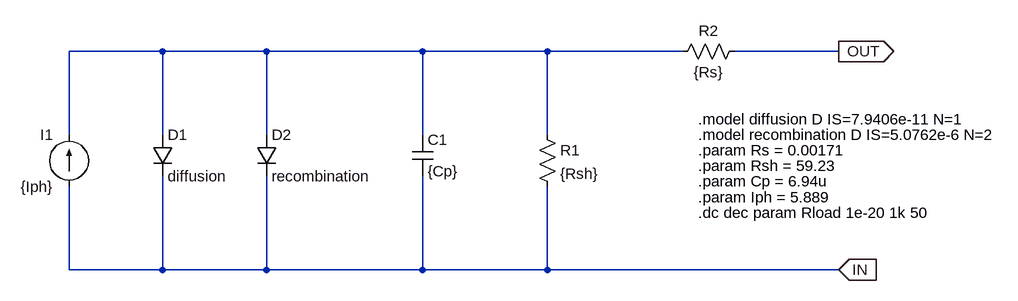
[diagram p0: schematic jac-cell.asc]
jac-cell.asc, the LTspice schematic file:
Version 4
SHEET 1 1300 784
WIRE 144 -16 0 -16
WIRE 304 -16 144 -16
WIRE 544 -16 304 -16
WIRE 736 -16 544 -16
WIRE 944 -16 736 -16
WIRE 1184 -16 1024 -16
WIRE 0 112 0 -16
WIRE 144 112 144 -16
WIRE 304 112 304 -16
WIRE 544 112 544 -16
WIRE 736 112 736 -16
WIRE 0 320 0 192
WIRE 144 320 144 176
WIRE 144 320 0 320
WIRE 304 320 304 176
WIRE 304 320 144 320
WIRE 544 320 544 176
WIRE 544 320 304 320
WIRE 736 320 736 192
WIRE 736 320 544 320
WIRE 1184 320 736 320
FLAG 1184 320 IN
IOPIN 1184 320 In
FLAG 1184 -16 OUT
IOPIN 1184 -16 Out
SYMBOL current 0 192 R180
WINDOW 0 24 80 Left 2
WINDOW 3 24 0 Left 2
SYMATTR InstName I1
SYMATTR Value {Iph}
SYMBOL diode 128 112 R0
SYMATTR InstName D1
SYMATTR Value diffusion
SYMBOL diode 288 112 R0
SYMATTR InstName D2
SYMATTR Value recombination
SYMBOL cap 528 112 R0
SYMATTR InstName C1
SYMATTR Value {Cp}
SYMBOL res 720 96 R0
SYMATTR InstName R1
SYMATTR Value {Rsh}
SYMBOL res 928 0 R270
WINDOW 0 32 56 VTop 2
WINDOW 3 0 56 VBottom 2
SYMATTR InstName R2
SYMATTR Value {Rs}
TEXT 968 88 Left 2 !.model diffusion D IS=7.9406e-11 N=1
TEXT 968 112 Left 2 !.model recombination D IS=5.0762e-6 N=2
TEXT 968 136 Left 2 !.param Rs = 0.00171
TEXT 968 160 Left 2 !.param Rsh = 59.23
TEXT 968 184 Left 2 !.param Cp = 6.94u
TEXT 968 208 Left 2 !.param Iph = 5.889
TEXT 968 232 Left 2 !.dc dec param Rload 1e-20 1k 50

The netlist it stands for:
* jac-cell.asc
I1 IN N001 {Iph}
D1 N001 IN diffusion
D2 N001 IN recombination
C1 N001 IN {Cp}
R1 N001 IN {Rsh}
R2 N001 OUT {Rs}
.model D D
.lib standard.dio
.model diffusion D IS=7.9406e-11 N=1
.model recombination D IS=5.0762e-6 N=2
.param Rs = 0.00171
.param Rsh = 59.23
.param Cp = 6.94u
.param Iph = 5.889
.dc dec param Rload 1e-20 1k 50
.backanno
.end